# Altium schematic sheet PWM_Pump_Led.SchDoc
size A4; SheetNumber: 7; SheetTotal: 11
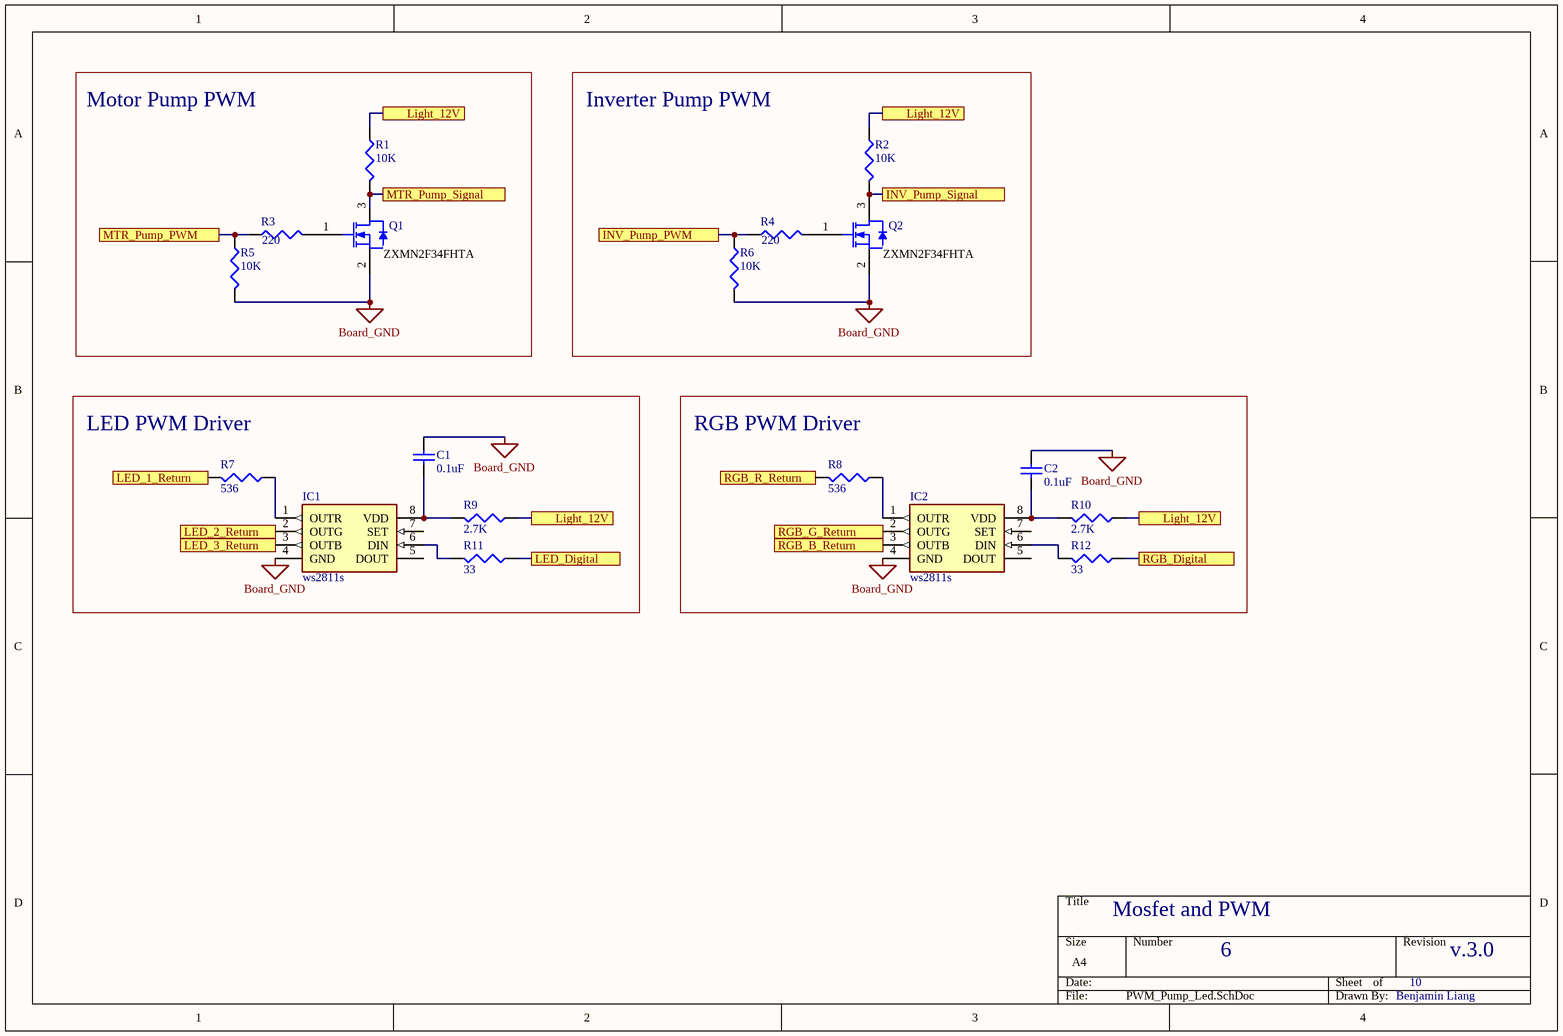
[diagram p0: PWM_Pump_Led.SchDoc]

## Parts
C1  0.1uF  [C1206]
C2  0.1uF  [C1206]
IC1  ws2811s  [SOIC127P600X175-8N]
IC2  ws2811s  [SOIC127P600X175-8N]
Q1  ZXMN2F34FHTA  [FAIR-SSOT3L-3_V]  (value not drawn)
Q2  ZXMN2F34FHTA  [FAIR-SSOT3L-3_V]  (value not drawn)
R1  10K  [J1-0603]
R2  10K  [J1-0603]
R3  220  [J1-0603]
R4  220  [J1-0603]
R5  10K  [J1-0603]
R6  10K  [J1-0603]
R7  536  [J1-0603]
R8  536  [J1-0603]
R9  2.7K  [J1-0603]
R10  2.7K  [J1-0603]
R11  33  [J1-0603]
R12  33  [J1-0603]

## Blocks framed on the sheet
Motor Pump PWM: Q1 R1 R3 R5
Inverter Pump PWM: Q2 R2 R4 R6
LED PWM Driver: C1 IC1 R7 R9 R11
RGB PWM Driver: C2 IC2 R8 R10 R12

## Ports
INV_Pump_PWM, INV_Pump_Signal, LED_1_Return, LED_2_Return, LED_3_Return, LED_Digital, Light_12V, MTR_Pump_PWM, MTR_Pump_Signal, RGB_B_Return, RGB_Digital, RGB_G_Return, RGB_R_Return

## Nets
Board_GND: C1.1 C2.1 IC1.4(GND) IC2.4(GND) Q1.2(S) Q2.2(S) R5.2 R6.2
INV_Pump_PWM: R4.1 R6.1 ; port INV_Pump_PWM
INV_Pump_Signal: Q2.3(D) R2.2 ; port INV_Pump_Signal
LED_1_Return: R7.2 ; port LED_1_Return
LED_2_Return: IC1.2(OUTG) ; port LED_2_Return
LED_3_Return: IC1.3(OUTB) ; port LED_3_Return
LED_Digital: R11.1 ; port LED_Digital
Light_12V: R1.1 R2.1 R9.1 R10.1 ; port Light_12V
MTR_Pump_PWM: R3.1 R5.1 ; port MTR_Pump_PWM
MTR_Pump_Signal: Q1.3(D) R1.2 ; port MTR_Pump_Signal
RGB_B_Return: IC2.3(OUTB) ; port RGB_B_Return
RGB_Digital: R12.1 ; port RGB_Digital
RGB_G_Return: IC2.2(OUTG) ; port RGB_G_Return
RGB_R_Return: R8.2 ; port RGB_R_Return
NetC1_2: C1.2 IC1.8(VDD) R9.2
NetC2_2: C2.2 IC2.8(VDD) R10.2
NetIC1_1: IC1.1(OUTR) R7.1
NetIC1_6: IC1.6(DIN) R11.2
NetIC2_1: IC2.1(OUTR) R8.1
NetIC2_6: IC2.6(DIN) R12.2
NetQ1_1: Q1.1(G) R3.2
NetQ2_1: Q2.1(G) R4.2

Not connected (* = marked no-connect by the designer): IC1 5(DOUT) 7(SET); IC2 5(DOUT) 7(SET)

## Notes on the sheet
- (near Q1) ZXMN2F34FHTA
- (near Q2) ZXMN2F34FHTA
- Mosfet and PWM
- 6
- 10
- v.3.0
- Benjamin Liang

## Library data of the parts
C1 C2 = Cap Semi: Capacitor (Semiconductor SIM Model); Value: 100nF; Published: 8-Jun-2000; LatestRevisionDate: 29-May-2009; LatestRevisionNote: IPC-7351 Footprint Added.; PackageReference: C1206; Publisher: Altium Limited; PackageDescription: Chip Capacitor
IC1 IC2 = ws2811s: Integrated Circuit; Manufacturer_Name: Worldsemi; Datasheet Link: https://cdn-shop.adafruit.com/datasheets/WS2811.pdf; Height: 1.75mm; Manufacturer_Part_Number: ws2811s
Q1 Q2 = CMP-2000-06249-1: Manufacturer: FairchildSemiconductor; RDS-on: 0.07@4.5VOhm; Typical Fall Time: 3ns; Maximum Drain Source Voltage: 20V; Rad Hard: No; Channel Mode: Enhancement; Package Version: Rev. 3, 05/2015; Maximum Gate Source Voltage: ±8V; Typical Rise Time: 8.5ns; Typical Turn-Off Delay Time: 11ns; Maximum Continuous Drain Current: 1.7A; Channel Type: N; Typical Turn-On Delay Time: 5ns; Packaging: Tape&Reel; Mounting Technology: SurfaceMount; Mounting: SurfaceMount; Manufacturer URL: https://www.fairchildsemi.com/; Datasheet URL: https://www.fairchildsemi.com/datasheets/FD/FDN335N.pdf; Package Description: 3-Pin Small Outline Transistor, Body 2.92 x 1.4 mm, Pitch 0.95 mm; Package URL: https://www.fairchildsemi.com/package-drawings/MA/MA03B.pdf; Datasheet Version: Rev. C, 04/1999; Package Reference: SSOT3L; Package: 3SuperSOT; Operating Temperature: -55to150°C; Category: MOSFET
R1 R2 R5 R6 = Res3: Resistor; Published: 8-Jun-2000; LatestRevisionDate: 29-May-2009; LatestRevisionNote: IPC-7351 Footprint Added.; PackageReference: J1-0603; Publisher: Altium Limited; PackageDescription: Chip Resistor; Value: 10K
R3 R4 R7-R12 = Res3: Resistor; Value: 10K; Published: 8-Jun-2000; LatestRevisionDate: 29-May-2009; LatestRevisionNote: IPC-7351 Footprint Added.; PackageReference: J1-0603; Publisher: Altium Limited; PackageDescription: Chip Resistor